# EAGLE design raspi_gpio_coupler (EAGLE 6.6.0)
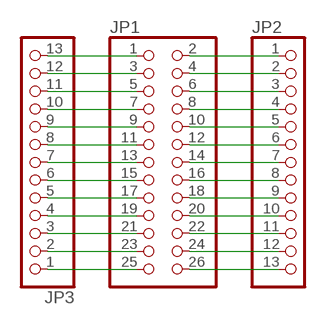
[diagram p0: schematic, sheet 1]

## Parts
JP1  PINHD-2X13  [2X13]
JP2  PINHD-1X13  [1X13]
JP3  PINHD-1X13  [1X13]

## Nets
N$1: JP1.1 JP3.13
N$2: JP1.3 JP3.12
N$3: JP1.5 JP3.11
N$4: JP1.7 JP3.10
N$5: JP1.9 JP3.9
N$6: JP1.11 JP3.8
N$7: JP1.13 JP3.7
N$8: JP1.15 JP3.6
N$9: JP1.17 JP3.5
N$10: JP1.19 JP3.4
N$11: JP1.21 JP3.3
N$12: JP1.23 JP3.2
N$13: JP1.25 JP3.1
N$14: JP1.2 JP2.1
N$15: JP1.4 JP2.2
N$16: JP1.6 JP2.3
N$17: JP1.8 JP2.4
N$18: JP1.10 JP2.5
N$19: JP1.12 JP2.6
N$20: JP1.14 JP2.7
N$21: JP1.16 JP2.8
N$22: JP1.18 JP2.9
N$23: JP1.20 JP2.10
N$24: JP1.22 JP2.11
N$25: JP1.24 JP2.12
N$26: JP1.26 JP2.13

## Library data of the parts
JP1 = pinhead:PINHD-2X13: PIN HEADER
JP2 JP3 = pinhead:PINHD-1X13: PIN HEADER

## Board
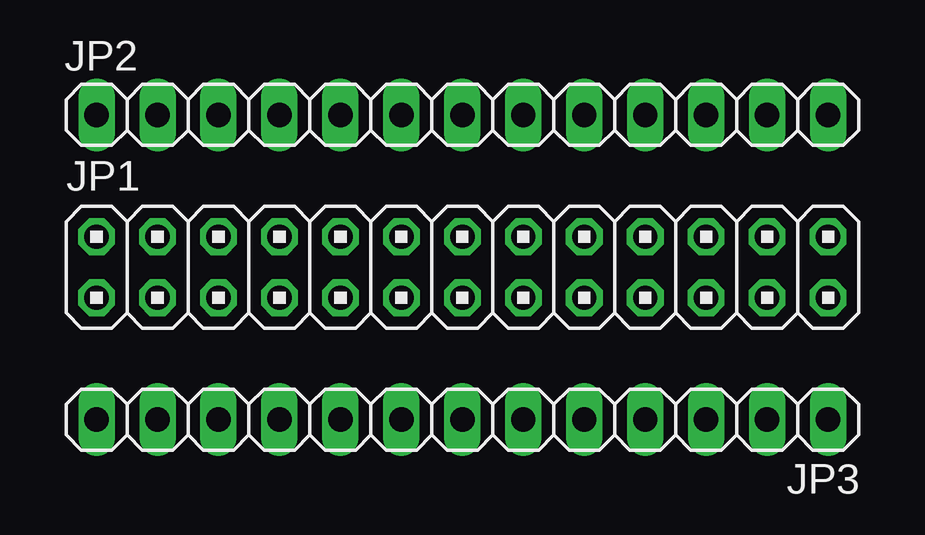
[diagram p1: board, top side]
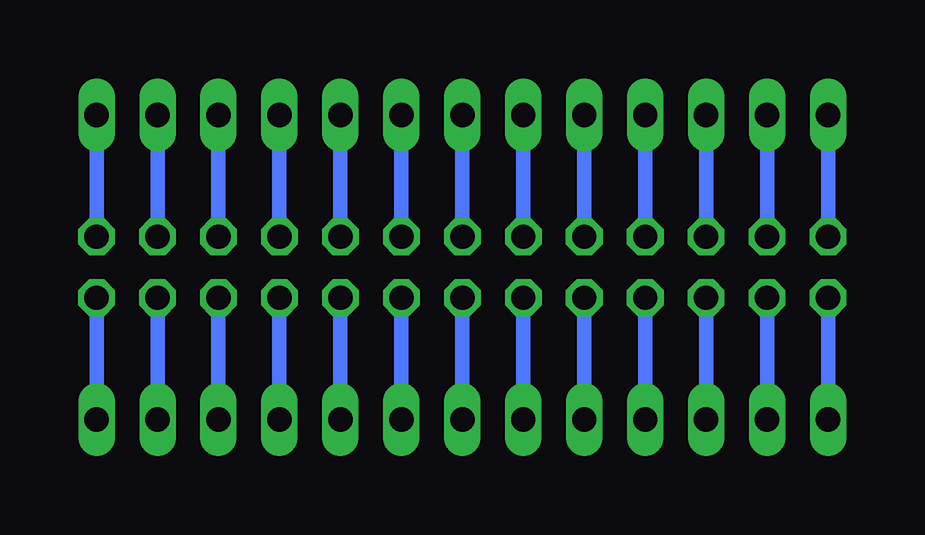
[diagram p2: board, bottom side, seen from below]

No outline drawn. Coordinates in mm, seen from the top.
Copper layers (1*16): Top 0.035mm / dielectric 1.5mm / Bottom 0.035mm
Design rules "default": minimum track width 10mil, minimum drill 24mil, track to track 8mil, track to pad 8mil, pad to pad 8mil, via to via 8mil, smd to smd 8mil, copper to edge 40mil, drill to drill 8mil, minimum pad ring 10mil, minimum via ring 8mil, stop-mask expansion 4mil, vias tented up to drill 0mil, thermal gap 10mil

### Footprints (pad centres in the part's own frame; a part is rotated, then mirrored left to right if it is on the bottom)
2X13 = drill 1.016 octagon: 1 -15.24,-1.27; 2 -15.24,1.27; 3 -12.7,-1.27; 4 -12.7,1.27; 5 -10.16,-1.27; 6 -10.16,1.27; 7 -7.62,-1.27; 8 -7.62,1.27; 9 -5.08,-1.27; 10 -5.08,1.27; 11 -2.54,-1.27; 12 -2.54,1.27; 13 0,-1.27; 14 0,1.27; 15 2.54,-1.27; 16 2.54,1.27; 17 5.08,-1.27; 18 5.08,1.27; 19 7.62,-1.27; 20 7.62,1.27; 21 10.16,-1.27; 22 10.16,1.27; 23 12.7,-1.27; 24 12.7,1.27; 25 15.24,-1.27; 26 15.24,1.27
1X13 = drill 1.016 long: 1 -15.24,0; 2 -12.7,0; 3 -10.16,0; 4 -7.62,0; 5 -5.08,0; 6 -2.54,0; 7 0,0; 8 2.54,0; 9 5.08,0; 10 7.62,0; 11 10.16,0; 12 12.7,0; 13 15.24,0

### Placement (x,y rotation side)
JP1  20.32,11.43 0 top
JP2  20.32,17.78 0 top
JP3  20.32,5.08 180 top

### Tracks (layer width: path | path; a pad name or v marks a point on that pad's centre or on a via)
N$1
  Bottom 0.61: JP3.13 JP1.1
N$2
  Bottom 0.61: JP3.12 JP1.3
N$3
  Bottom 0.61: JP3.11 JP1.5
N$4
  Bottom 0.61: JP3.10 JP1.7
N$5
  Bottom 0.61: JP3.9 JP1.9
N$6
  Bottom 0.61: JP3.8 JP1.11
N$7
  Bottom 0.61: JP3.7 JP1.13
N$8
  Bottom 0.61: JP3.6 JP1.15
N$9
  Bottom 0.61: JP3.5 JP1.17
N$10
  Bottom 0.61: JP3.4 JP1.19
N$11
  Bottom 0.61: JP3.3 JP1.21
N$12
  Bottom 0.61: JP3.2 JP1.23
N$13
  Bottom 0.61: JP3.1 JP1.25
N$14
  Bottom 0.61: JP1.2 JP2.1
N$15
  Bottom 0.61: JP1.4 JP2.2
N$16
  Bottom 0.61: JP1.6 JP2.3
N$17
  Bottom 0.61: JP1.8 JP2.4
N$18
  Bottom 0.61: JP1.10 JP2.5
N$19
  Bottom 0.61: JP1.12 JP2.6
N$20
  Bottom 0.61: JP1.14 JP2.7
N$21
  Bottom 0.61: JP1.16 JP2.8
N$22
  Bottom 0.61: JP1.18 JP2.9
N$23
  Bottom 0.61: JP1.20 JP2.10
N$24
  Bottom 0.61: JP1.22 JP2.11
N$25
  Bottom 0.61: JP1.24 JP2.12
N$26
  Bottom 0.61: JP1.26 JP2.13